# EAGLE schematic 200W_4FET_Load_v11 (EAGLE 6.1)
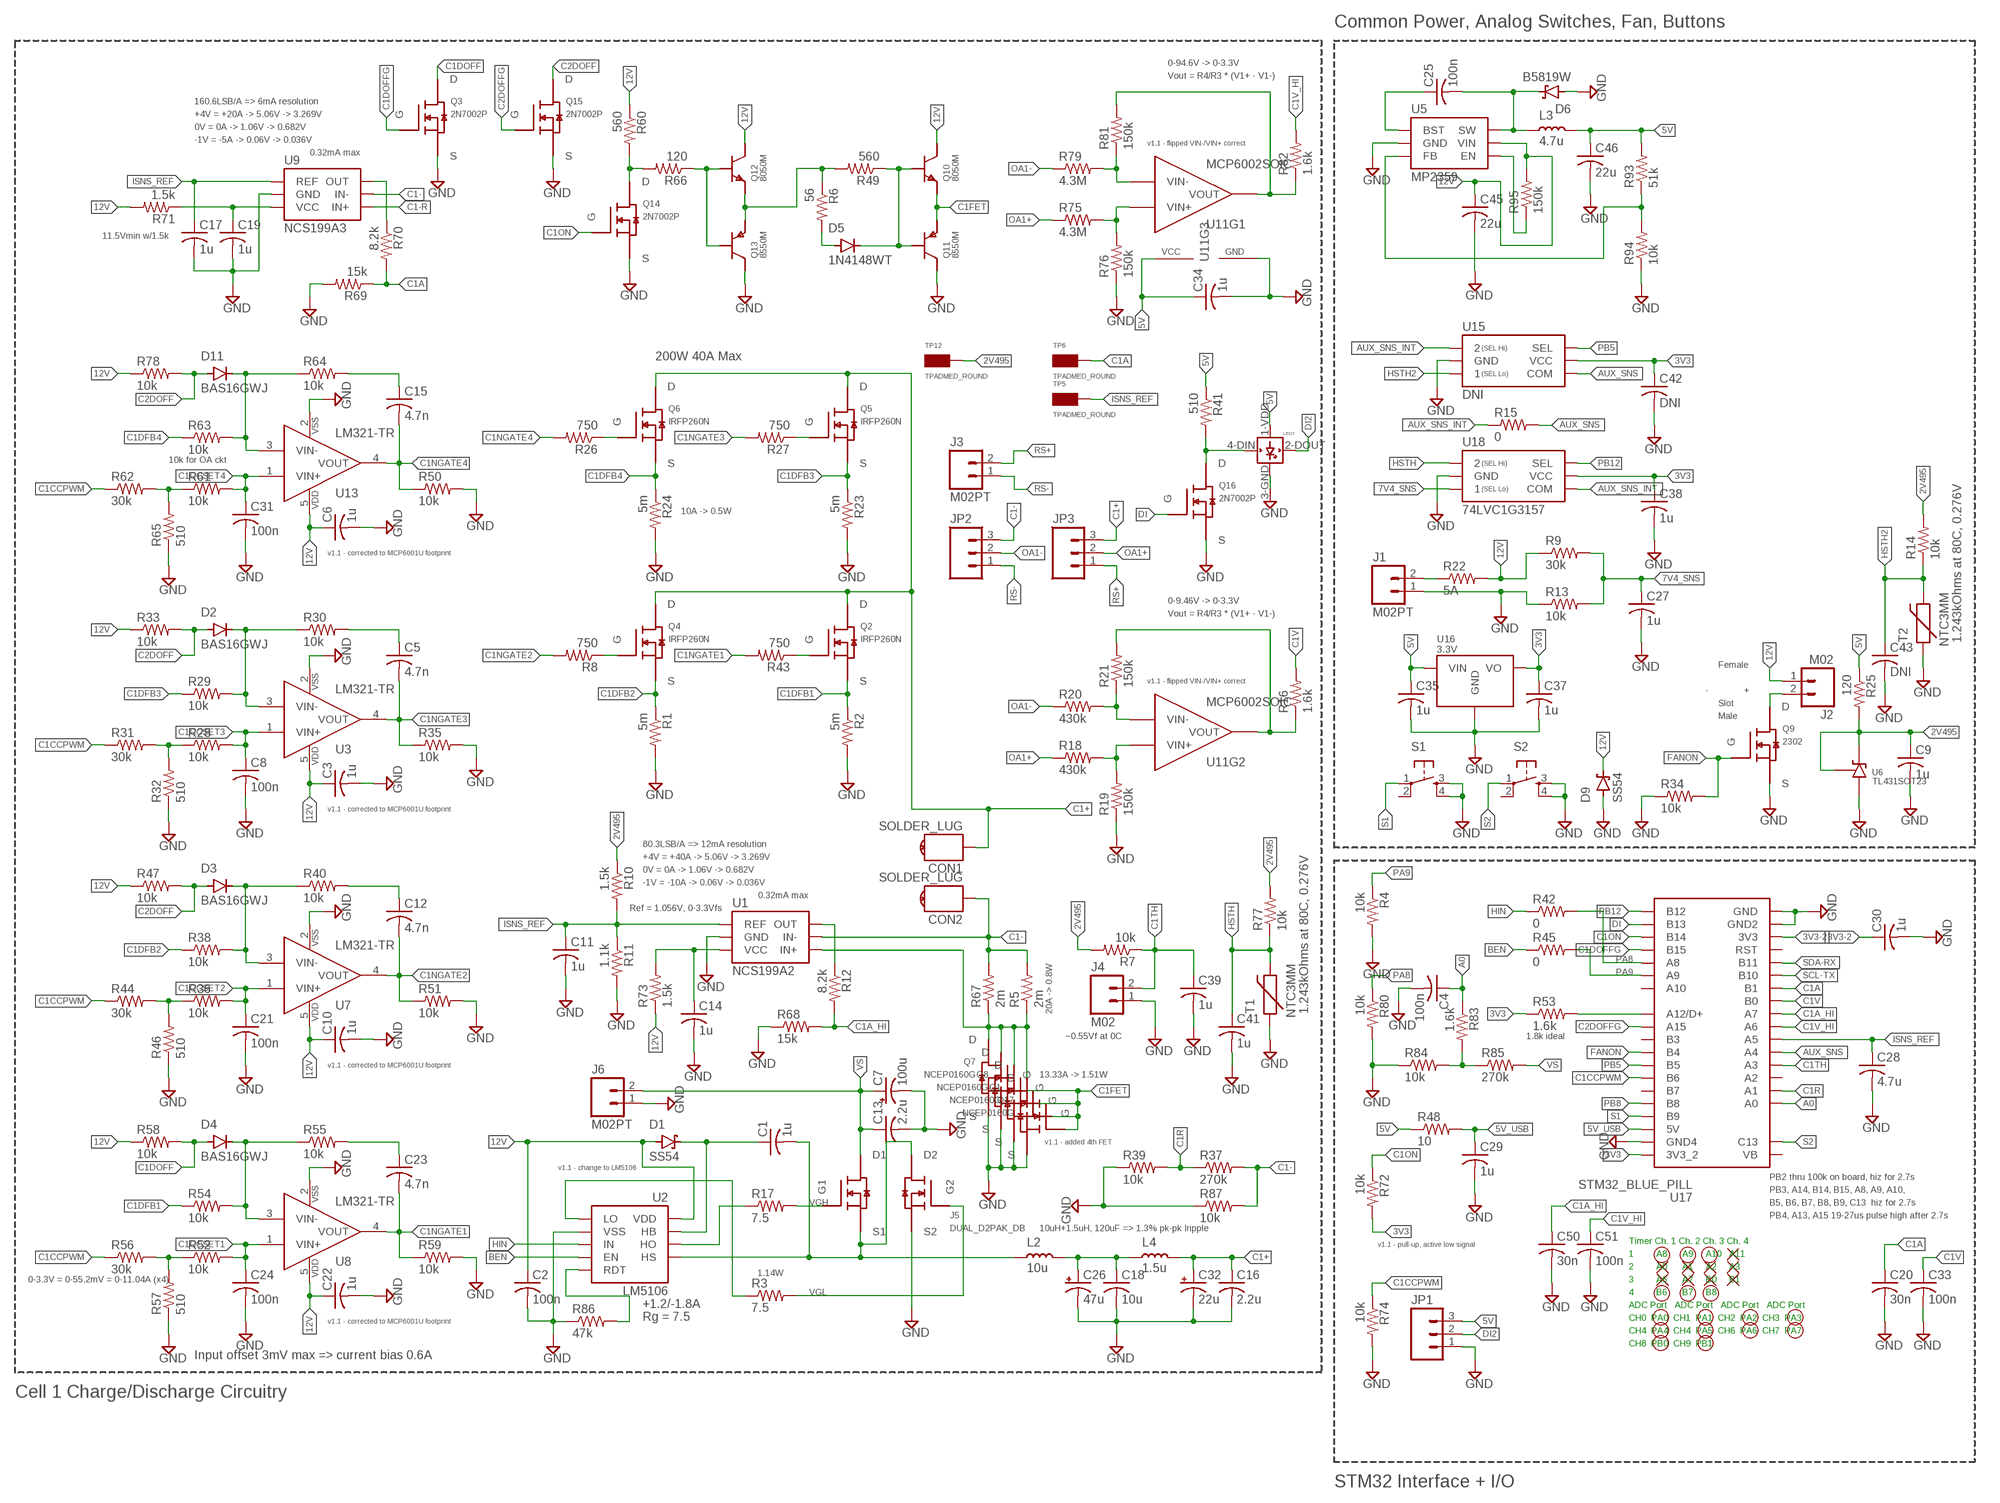
[diagram p0: schematic, sheet 1]

## Parts
C1  1u  C-USC0603  [C0603]
C2  100n  C-USC0603  [C0603]
C3  1u  C-USC0402  [C0402]
C4  100n  C-USC0402  [C0402]
C5  4.7n  C-USC0402  [C0402]
C6  1u  C-USC0402  [C0402]
C7  100u  CPOL-USE2,5-6E  [E2,5-6E]
C8  100n  C-USC0402  [C0402]
C9  1u  C-USC0402  [C0402]
C10  1u  C-USC0402  [C0402]
C11  1u  C-USC0402  [C0402]
C12  4.7n  C-USC0402  [C0402]
C13  2.2u  C-USC1210  [C1210]
C14  1u  C-USC0402  [C0402]
C15  4.7n  C-USC0402  [C0402]
C16  2.2u  C-USC1210  [C1210]
C17  1u  C-USC0402  [C0402]
C18  10u  C-USC2220K  [C2220K]
C19  1u  C-USC0402  [C0402]
C20  30n  C-USC0402  [C0402]
C21  100n  C-USC0402  [C0402]
C22  1u  C-USC0402  [C0402]
C23  4.7n  C-USC0402  [C0402]
C24  100n  C-USC0402  [C0402]
C25  100n  C-USC0402  [C0402]
C26  47u  CPOL-USE3.5-8  [E3,5-8]
C27  1u  C-USC0402  [C0402]
C28  4.7u  C-USC0402  [C0402]
C29  1u  C-USC0402  [C0402]
C30  1u  C-USC0402  [C0402]
C31  100n  C-USC0402  [C0402]
C32  22u  CPOL-USE2,5-6E  [E2,5-6E]
C33  100n  C-USC0402  [C0402]
C34  1u  C-USC0402  [C0402]
C35  1u  C-USC0402  [C0402]
C37  1u  C-USC0402  [C0402]
C38  1u  C-USC0402  [C0402]
C39  1u  C-USC0402  [C0402]
C41  1u  C-USC0402  [C0402]
C42  DNI  C-USC0402  [C0402]
C43  DNI  C-USC0402  [C0402]
C45  22u  C-USC0805  [C0805]
C46  22u  C-USC0603  [C0603]
C50  30n  C-USC0402  [C0402]
C51  100n  C-USC0402  [C0402]
CON1  SOLDER_LUG  [M4_RA_SOLDTERM]
CON2  SOLDER_LUG  [M4_RA_SOLDTERM]
D1  SS54  [SMA]
D2  BAS16GWJ  BAT60A  [SOD323]
D3  BAS16GWJ  BAT60A  [SOD323]
D4  BAS16GWJ  BAT60A  [SOD323]
D5  1N4148WT  [SOD523]
D6  B5819W  PMEG3020ER  [SOD123W]
D9  SS54  [SMA]
D11  BAS16GWJ  BAT60A  [SOD323]
J1  M02PT  [PHOENIXCONTACT1935161]
J2  M02  [B2B-XH-A]
J3  M02PT  [PHOENIXCONTACT1935161]
J4  M02  [B2B-XH-A]
J5  DUAL_D2PAK_DB  [DUAL_D2PAK_DB]
J6  M02PT  [PHOENIXCONTACT1935161]
JP1  M03PTH  [1X03]
JP2  M03PTH  [1X03]
JP3  M03PTH  [1X03]
L2  10u  INDUCTOR13P8  [INDUCTOR_13.8X12.7]
L3  4.7u  INDUCTOR0805  [0805]
L4  1.5u  INDUCTOR  [INDUCTOR_7.4X6.6MM]
LED7  WS2812B  [WS2812B]
Q1  NCEP0160G  [DFN5X6-8L]
Q2  IRFP260N  [TO-247]
Q3  2N7002P  [SOT23]
Q4  IRFP260N  [TO-247]
Q5  IRFP260N  [TO-247]
Q6  IRFP260N  [TO-247]
Q7  NCEP0160G  [DFN5X6-8L]
Q8  NCEP0160G  [DFN5X6-8L]
Q9  2302  2N7002P  [SOT23]
Q10  8050M  [SOT23]
Q11  8550M  [SOT23]
Q12  8050M  [SOT23]
Q13  8550M  [SOT23]
Q14  2N7002P  [SOT23]
Q15  2N7002P  [SOT23]
Q16  2N7002P  [SOT23]
Q17  NCEP0160G  [DFN5X6-8L]
R1  5m  R-US_R1206  [R1206]
R2  5m  R-US_R1206  [R1206]
R3  7.5  R-US_R2512  [R2512]
R4  10k  R-US_R0402  [R0402]
R5  2m  R-US_R2512  [R2512]
R6  56  R-US_R0402  [R0402]
R7  10k  R-US_R0402  [R0402]
R8  750  R-US_R0402  [R0402]
R9  30k  R-US_R0402  [R0402]
R10  1.5k  R-US_R0402  [R0402]
R11  1.1k  R-US_R0402  [R0402]
R12  8.2k  R-US_R0402  [R0402]
R13  10k  R-US_R0402  [R0402]
R14  10k  R-US_R0402  [R0402]
R15  0  R-US_R0402  [R0402]
R16  1.6k  R-US_R0402  [R0402]
R17  7.5  R-US_R2512  [R2512]
R18  430k  R-US_R0402  [R0402]
R19  150k  R-US_R0402  [R0402]
R20  430k  R-US_R0402  [R0402]
R21  150k  R-US_R0402  [R0402]
R22  5A  R-US_R1206  [R1206]
R23  5m  R-US_R1206  [R1206]
R24  5m  R-US_R1206  [R1206]
R25  120  R-US_R0402  [R0402]
R26  750  R-US_R0402  [R0402]
R27  750  R-US_R0402  [R0402]
R28  10k  R-US_R0402  [R0402]
R29  10k  R-US_R0402  [R0402]
R30  10k  R-US_R0402  [R0402]
R31  30k  R-US_R0402  [R0402]
R32  510  R-US_R0402  [R0402]
R33  10k  R-US_R0402  [R0402]
R34  10k  R-US_R0402  [R0402]
R35  10k  R-US_R0402  [R0402]
R36  10k  R-US_R0402  [R0402]
R37  270k  R-US_R0402  [R0402]
R38  10k  R-US_R0402  [R0402]
R39  10k  R-US_R0402  [R0402]
R40  10k  R-US_R0402  [R0402]
R41  510  R-US_R0402  [R0402]
R42  0  R-US_R0402  [R0402]
R43  750  R-US_R0402  [R0402]
R44  30k  R-US_R0402  [R0402]
R45  0  R-US_R0402  [R0402]
R46  510  R-US_R0402  [R0402]
R47  10k  R-US_R0402  [R0402]
R48  10  R-US_R0402  [R0402]
R49  560  R-US_R0402  [R0402]
R50  10k  R-US_R0402  [R0402]
R51  10k  R-US_R0402  [R0402]
R52  10k  R-US_R0402  [R0402]
R53  1.6k  R-US_R0402  [R0402]
R54  10k  R-US_R0402  [R0402]
R55  10k  R-US_R0402  [R0402]
R56  30k  R-US_R0402  [R0402]
R57  510  R-US_R0402  [R0402]
R58  10k  R-US_R0402  [R0402]
R59  10k  R-US_R0402  [R0402]
R60  560  R-US_R0402  [R0402]
R61  10k  R-US_R0402  [R0402]
R62  30k  R-US_R0402  [R0402]
R63  10k  R-US_R0402  [R0402]
R64  10k  R-US_R0402  [R0402]
R65  510  R-US_R0402  [R0402]
R66  120  R-US_R0402  [R0402]
R67  2m  R-US_R2512  [R2512]
R68  15k  R-US_R0402  [R0402]
R69  15k  R-US_R0402  [R0402]
R70  8.2k  R-US_R0402  [R0402]
R71  1.5k  R-US_R0402  [R0402]
R72  10k  R-US_R0402  [R0402]
R73  1.5k  R-US_R0402  [R0402]
R74  10k  R-US_R0402  [R0402]
R75  4.3M  R-US_R0402  [R0402]
R76  150k  R-US_R0402  [R0402]
R77  10k  R-US_R0402  [R0402]
R78  10k  R-US_R0402  [R0402]
R79  4.3M  R-US_R0402  [R0402]
R80  10k  R-US_R0402  [R0402]
R81  150k  R-US_R0402  [R0402]
R82  1.6k  R-US_R0402  [R0402]
R83  1.6k  R-US_R0402  [R0402]
R84  10k  R-US_R0402  [R0402]
R85  270k  R-US_R0402  [R0402]
R86  47k  R-US_R0402  [R0402]
R87  10k  R-US_R1206  [R1206]
R93  51k  R-US_R0402  [R0402]
R94  10k  R-US_R0402  [R0402]
R95  150k  R-US_R0402  [R0402]
S1  TAC_SWITCHSMD  [TACTILE_SWITCH_SMD]
S2  TAC_SWITCHSMD  [TACTILE_SWITCH_SMD]
T1  NTC3MM  PTCNTC3MM  [THERMISTOR_3MMX3MM]
T2  NTC3MM  PTCNTC3MM  [THERMISTOR_3MMX3MM]
TP5  TPADMED_ROUND  [TPAD_MED_ROUND]
TP6  TPADMED_ROUND  [TPAD_MED_ROUND]
TP12  TPADMED_ROUND  [TPAD_MED_ROUND]
U1  NCS199A2  INA214  [SOT-363]
U2  LM5106  [10-TSSOP]
U3  LM321-TR  MCP6001U  [SOT23-5]
U5  MP2359  JW5052C  [SOT23-6]
U6  TL431SOT23  [SOT23]
U7  LM321-TR  MCP6001U  [SOT23-5]
U8  LM321-TR  MCP6001U  [SOT23-5]
U9  NCS199A3  INA214  [SOT-363]
U11  MCP6002SOIC  [8-SOIC]
U13  LM321-TR  MCP6001U  [SOT23-5]
U15  DNI  SN74LVC1G3157SC70-6  [SC70-6]
U16  3.3V  AP1117UR133-B  [SOT-89]
U17  STM32_BLUE_PILL  [STM32_BLUE_PILL_USABLE]
U18  74LVC1G3157  SN74LVC1G3157SC70-6  [SC70-6]

## Nets
2V495: C9.1 R7.2 R10.1 R14.2 R25.2 R77.2 TP12.1 U6.1(K) U6.2(REF)
3V3: C37.1 C38.1 C42.1 R53.1 R72.2 U15.5(VCC) U16.1(VO) U17.3V3_2 U18.5(VCC)
3V3-2: C30.1 U17.3V3
5V: C34.1 C35.1 C46.1 JP1.3 L3.2 LED7.1-VDD(VDD) R25.1 R41.1 R48.1 R93.2 U11.8(VCC) U16.3(VIN)
5V_USB: C29.1 R48.2 U17.5V
7V4_SNS: C27.1 R9.2 R13.2 U18.3
12V: C2.1 C3.1 C6.1 C10.1 C22.1 C45.1 D1.A(ANODE) D9.K(CATHODE) J2.1 Q10.3(C) Q12.3(C) R9.1 R22.2 R33.1 R47.1 R58.1 R60.1 R71.2 R73.1 R78.1 R95.2 U2.1(VDD) U3.5(VDD) U5.5(VIN) U7.5(VDD) U8.5(VDD) U13.5(VDD)
A0: C4.1 R83.1 U17.A0
AUX_SNS: R15.2 U15.4(COM) U17.A4
AUX_SNS_INT: R15.1 U15.1 U18.4(COM)
BASE1: Q12.1(B) Q13.1(B) R66.1
BASE2: D5.K(CATHODE) Q10.1(B) Q11.1(B) R49.1
BEN: R45.1 U2.7(EN)
C1+ [100v]: C16.1 C32.+ CON1.P$1 CON1.P$2 CON1.P$3 CON1.P$4 JP3.3 L4.2 Q2.2(D) Q4.2(D) Q5.2(D) Q6.2(D)
C1-: CON2.P$1 CON2.P$2 CON2.P$3 CON2.P$4 JP2.3 R5.2 R37.2 R67.2 R87.2 U1.5(IN-) U9.5(IN-)
C1-R: Q1.EP(D) Q1.EP-TL(D) Q1.EP-TLL(D) Q1.EP-TR(D) Q1.EP-TRR(D) Q7.EP(D) Q7.EP-TL(D) Q7.EP-TLL(D) Q7.EP-TR(D) Q7.EP-TRR(D) Q8.EP(D) Q8.EP-TL(D) Q8.EP-TLL(D) Q8.EP-TR(D) Q8.EP-TRR(D) Q17.EP(D) Q17.EP-TL(D) Q17.EP-TLL(D) Q17.EP-TR(D) Q17.EP-TRR(D) R5.1 R67.1 U1.4(IN+) U9.4(IN+)
C1A: C20.1 R69.1 R70.2 TP6.1 U17.B1
C1A_HI: C50.1 R12.2 R68.2 U17.A7
C1CCPWM: R31.1 R44.1 R56.1 R62.1 R74.1 U17.B6
C1CCSET1: C24.1 R52.2 U8.1(VIN+)
C1CCSET2: C21.1 R36.2 U7.1(VIN+)
C1CCSET3: C8.1 R28.2 U3.1(VIN+)
C1CCSET4: C31.1 R61.2 U13.1(VIN+)
C1DFB1: Q2.3(S) R2.1 R54.1
C1DFB2: Q4.3(S) R1.1 R38.1
C1DFB3: Q5.3(S) R23.1 R29.1
C1DFB4: Q6.3(S) R24.1 R63.1
C1DOFF: D4.A(ANODE) Q3.3(D) R58.2
C1DOFFG: Q3.1(G) U17.B15
C1FET: Q1.4(G) Q7.4(G) Q8.4(G) Q10.2(E) Q11.2(E) Q17.4(G)
C1NGATE1: C23.2 R43.2 R59.1 U8.4(VOUT)
C1NGATE2: C12.2 R8.2 R51.1 U7.4(VOUT)
C1NGATE3: C5.2 R27.2 R35.1 U3.4(VOUT)
C1NGATE4: C15.2 R26.2 R50.1 U13.4(VOUT)
C1ON: Q14.1(G) R72.1 U17.B14
C1R: R37.1 R39.2 U17.A1
C1TH: C39.1 J4.2 R7.1 U17.A3
C1V: C33.1 R16.2 U17.B0
C1V_HI: C51.1 R82.2 U17.A6
C1V_OA: R16.1 R21.2 U11.7(VOUT)
C1V_OA1: R81.2 R82.1 U11.1(VOUT)
C1VFBN: C15.1 R64.2
C1VFBN1: C5.1 R30.2
C1VFBN2: C12.1 R40.2
C1VFBN3: C23.1 R55.2
C2DOFF: D2.A(ANODE) D3.A(ANODE) D11.A(ANODE) Q15.3(D) R33.2 R47.2 R78.2
C2DOFFG: Q15.1(G) U17.A15
DI: Q16.1(G) U17.B13
DI1: LED7.4-DIN(DIN) Q16.3(D) R41.2
DI2: JP1.2 LED7.2-DOUT(DOUT)
FANON: Q9.1(G) R34.2 U17.B4
GND: C2.2 C3.2 C4.2 C6.2 C7.- C8.2 C9.2 C10.2 C11.2 C13.2 C14.2 C16.2 C17.2 C18.2 C19.2 C20.2 C21.2 C22.2 C24.2 C26.- C27.2 C28.2 C29.2 C30.2 C31.2 C32.- C33.2 C34.2 C35.2 C37.2 C38.2 C39.2 C41.2 C42.2 C43.2 C45.2 C46.2 C50.2 C51.2 D6.A(ANODE) D9.A(ANODE) J1.1 J4.1 J5.S2 J6.1 JP1.1 LED7.3-GND(GND) Q1.1(S) Q1.2(S) Q1.3(S) Q3.2(S) Q7.1(S) Q7.2(S) Q7.3(S) Q8.1(S) Q8.2(S) Q8.3(S) Q9.2(S) Q11.3(C) Q13.3(C) Q14.2(S) Q15.2(S) Q16.2(S) Q17.1(S) Q17.2(S) Q17.3(S) R1.2 R2.2 R4.2 R11.2 R13.1 R19.1 R23.2 R24.2 R32.1 R34.1 R35.2 R39.1 R46.1 R50.2 R51.2 R57.1 R59.2 R65.1 R68.1 R69.2 R74.2 R76.1 R80.2 R84.1 R86.1 R87.1 R94.1 S1.3 S1.4 S2.3 S2.4 T1.1 T2.1 U1.2(GND) U2.9(VSS) U3.2(VSS) U5.2(GND) U6.3(A) U7.2(VSS) U8.2(VSS) U9.2(GND) U11.4(GND) U13.2(VSS) U15.2(GND) U16.2(GND) U16.2@1(GND) U17.GND U17.GND2 U17.GND4 U18.2(GND)
HIN: R42.1 U2.8(IN)
HO: R17.1 U2.3(HO)
HSTH: C41.1 R77.1 T1.2 U18.1
HSTH2: C43.1 R14.1 T2.2 U15.3
I1SET: R61.1 R62.2 R65.2
I1SET1: R28.1 R31.2 R32.2
I1SET2: R36.1 R44.2 R46.2
I1SET3: R52.1 R56.2 R57.2
IS1O: R12.1 U1.6(OUT)
ISNS_REF: C11.1 C17.1 C28.1 R10.2 R11.1 TP5.1 U1.1(REF) U9.1(REF) U17.A5
LO: R3.1 U2.10(LO)
N$1: R75.2 R76.2 U11.3(VIN+)
N$2: D2.K(CATHODE) R29.2 R30.1 U3.3(VIN-)
N$3: R18.2 R19.2 U11.5(VIN+)
N$4: R20.2 R21.1 U11.6(VIN-)
N$5: D3.K(CATHODE) R38.2 R40.1 U7.3(VIN-)
N$6: D4.K(CATHODE) R54.2 R55.1 U8.3(VIN-)
N$7: C18.1 C26.+ L2.2 L4.1
N$8: C25.1 U5.1(BST)
N$9: R79.2 R81.1 U11.2(VIN-)
N$10: Q14.3(D) R60.2 R66.2
N$12: D5.A(ANODE) R6.2
N$13: J1.2 R22.1
N$14: Q12.2(E) Q13.2(E) R6.1 R49.2
N$15: R83.2 R84.2 R85.1
N$17: R70.1 U9.6(OUT)
N$18: R93.1 R94.2 U5.3(FB)
N$19: R86.2 U2.6(RDT)
N$23: R95.1 U5.4(EN)
N$24: D11.K(CATHODE) R63.2 R64.1 U13.3(VIN-)
N$26: R53.2 U17.A12(A12/D+)
N$34: J2.2 Q9.3(D)
NCSVCC: C19.1 R71.1 U9.3(VCC)
NCSVCC2: C14.1 R73.2 U1.3(VCC)
OA1+: JP3.2 R18.1 R75.1
OA1-: JP2.2 R20.1 R79.1
PA8: R42.2 R80.1 U17.A8
PA9: R4.1 R45.2 U17.A9
PB5: U15.6(SEL) U17.B5
PB8: U17.B8
PB12: U17.B12 U18.6(SEL)
Q7G: Q2.1(G) R43.1
Q7G1: Q4.1(G) R8.1
Q7G2: Q6.1(G) R26.1
Q7G3: Q5.1(G) R27.1
RS+: J3.2 JP3.1
RS-: J3.1 JP2.1
S1: S1.1 U17.B9
S2: S2.1 U17.C13
SCL-TX: U17.B10
SDA-RX: U17.B11
SW5V: C25.2 D6.K(CATHODE) L3.1 U5.6(SW)
VBST: C1.1 D1.K(CATHODE) U2.2(HB)
VGH: J5.G1 R17.2
VGL: J5.G2 R3.2
VMID: C1.2 J5.D2 J5.S1 L2.1 U2.4(HS)
VS [100v]: C7.+ C13.1 J5.D1 J6.2 R85.2
Unconnected: S1.2 S2.2 U17.A2 U17.A10 U17.B3 U17.B7 U17.RST U17.VBAT(VB)

## Notes on the sheet
- Common Power, Analog Switches, Fan, Buttons
- 0-94.6V -> 0-3.3V
- Vout = R4/R3 * (V1+ - V1-)
- 160.6LSB/A => 6mA resolution
- +4V = +20A -> 5.06V -> 3.269V
- 0V = 0A -> 1.06V -> 0.682V
- -1V = -5A -> 0.06V -> 0.036V
- v1.1 - flipped VIN-/VIN+ correct
- 0.32mA max
- 11.5Vmin w/1.5k
- 200W 40A Max
- 10k for OA ckt
- 10A -> 0.5W
- v1.1 - corrected to MCP6001U footprint
- 0-9.46V -> 0-3.3V
- Vout = R4/R3 * (V1+ - V1-)
- 1.243kOhms at 80C, 0.276V
- Female
- v1.1 - flipped VIN-/VIN+ correct
- - | +
- Slot
- Male
- v1.1 - corrected to MCP6001U footprint
- 80.3LSB/A => 12mA resolution
- +4V = +40A -> 5.06V -> 3.269V
- 0V = 0A -> 1.06V -> 0.682V
- -1V = -10A -> 0.06V -> 0.036V
- 0.32mA max
- Ref = 1.056V, 0-3.3Vfs
- 20A -> 0.8W | 1.243kOhms at 80C, 0.276V
- ~0.55Vf at 0C | 1.8k ideal
- v1.1 - corrected to MCP6001U footprint
- 13.33A -> 1.51W
- v1.1 - added 4th FET
- v1.1 - change to LM5106
- PB2 thru 100k on board, hiz for 2.7s
- PB3, A14, B14, B15, A8, A9, A10,
- B5, B6, B7, B8, B9, C13  hiz for 2.7s
- PB4, A13, A15 19-27us pulse high after 2.7s
- 10uH+1.5uH, 120uF => 1.3% pk-pk Iripple
- Timer Ch. 1 Ch. 2 Ch. 3 Ch. 4
- v1.1 - pull-up, active low signal
- 1         A8      A9     A10   A11
- 1.14W | 2         A0      A1     A2     A3
- 0-3.3V = 0-55.2mV = 0-11.04A (x4) | 3         A6      A7     B0     B1
- 4         B6      B7     B8
- +1.2/-1.8A | ADC Port   ADC Port   ADC Port   ADC Port
- Rg = 7.5 | CH0  PA0  CH1  PA1  CH2  PA2  CH3  PA3
- v1.1 - corrected to MCP6001U footprint
- CH4  PA4  CH4  PA5  CH6  PA6  CH7  PA7
- CH8  PB0  CH9  PB1
- Input offset 3mV max => current bias 0.6A
- Cell 1 Charge/Discharge Circuitry
- STM32 Interface + I/O

## Library data of the parts
C1-C6 C8-C25 C27-C31 C33-C35 C37-C39 C41-C43 C45 C46 C50 C51 = resistor:C-US: CAPACITOR, American symbol
C7 C26 C32 = resistor:CPOL-US: POLARIZED CAPACITOR, American symbol
CON1 CON2 = custom:SOLDER_LUG: Keystone 7764 (15A) 30A Tin plated Iron (Aliexpress) Tinned Copper (Aliexpress)
D1 D9 = custom:SS54: Diode Schottky 40V 5A 1mA Ir 0.55Vf
D2-D4 D11 = custom:BAT60A: Schottky Diode 10V 3A 0.37V at 1A
D5 = custom:1N4148WT: Standard Diode 150mA 75V Vf 1.25V @150mA, 0.855 @10mA, Ir 1.0uA @Vr=75V, 2.0pF, Trr = 4.0ns
D6 = custom:PMEG3020ER: Schottky Diode 30V 2A 0.42V 1.5mA Leakage
J1-J4 J6 = custom:M02
J5 = custom:DUAL_D2PAK_DB
JP1-JP3 = SparkFun:M03: Header 3 Standard 3-pin 0.1" header. Use with straight break away headers (SKU : PRT-00116), right angle break away headers (PRT-00553), swiss pins (PRT-00743), machine pins (PRT-00117), and female headers (PRT-00115). Molex polarized connector foot print use with SKU : PRT-08232 with associated crimp pins and housings.
L2-L4 = custom:INDUCTOR
LED7 = adafruit:WS2812B
Q1 Q7 Q8 Q17 = custom:NCEP0160G: N-Channel MOSFET 100V 60A 8.5mOhm @Vgs=10V Qg 48nC
Q2 Q4-Q6 = custom:IRFP260N: N-Channel MOSFET 200V 0.04Ω @10Vgs 50A 234nC
Q3 Q9 Q14-Q16 = custom:2N7002P: 2N7002P N-channel MOSFET 60V 360mA Logic Level
Q10 Q12 = custom:8050M: NPN Transistor 25V 1.5A hFE 4 @800mA fT 100MHz 625mW
Q11 Q13 = custom:8550M: PNP Transistor 25V 1.5A hFE 40 @800mA fT 100MHz 625mW
R1-R87 R93-R95 = resistor:R-US_: RESISTOR, American symbol
S1 S2 = SparkFun:TAC_SWITCH: Momentary Switch Button commonly used for reset or general input. Spark Fun Electronics SKU : COM-00097
T1 T2 = custom:PTC
TP5 TP6 TP12 = custom:TPAD
U1 U9 = custom:INA214: Current Shunt Amplifier 30kHz 2.7-26V
U2 = custom:LM5106: Gate Driver IC 100V Half-Bridge Programmable Dead-Time 1.8Apk Sink, 1.2Apk Source tr 15ns, tf 10ns @1000 pF
U3 U7 U8 U13 = custom:MCP6001: Op-Amp Single Rail-to-Rail 1MHz
U5 = custom:JW5052C: Buck Regulator Synchronous 4.5-18V 2A 700kHz 100uA 120mOhm
U6 = custom:TL431: Shunt Voltage Reference IC 700uA 100mA 36V
U11 = custom:MCP6002: Op-Amp Dual Rail-to-Rail 1MHz
U15 U18 = custom:SN74LVC1G3157: Single Analog Mux IC Switch 2:1 15 Ohm 1.65-5.5V
U16 = custom:AP1117: Linear Voltage Regulator 18V Max 1A
U17 = custom:STM32_BLUE_PILL

## Net classes
1 100v: clearance 0.203 mm